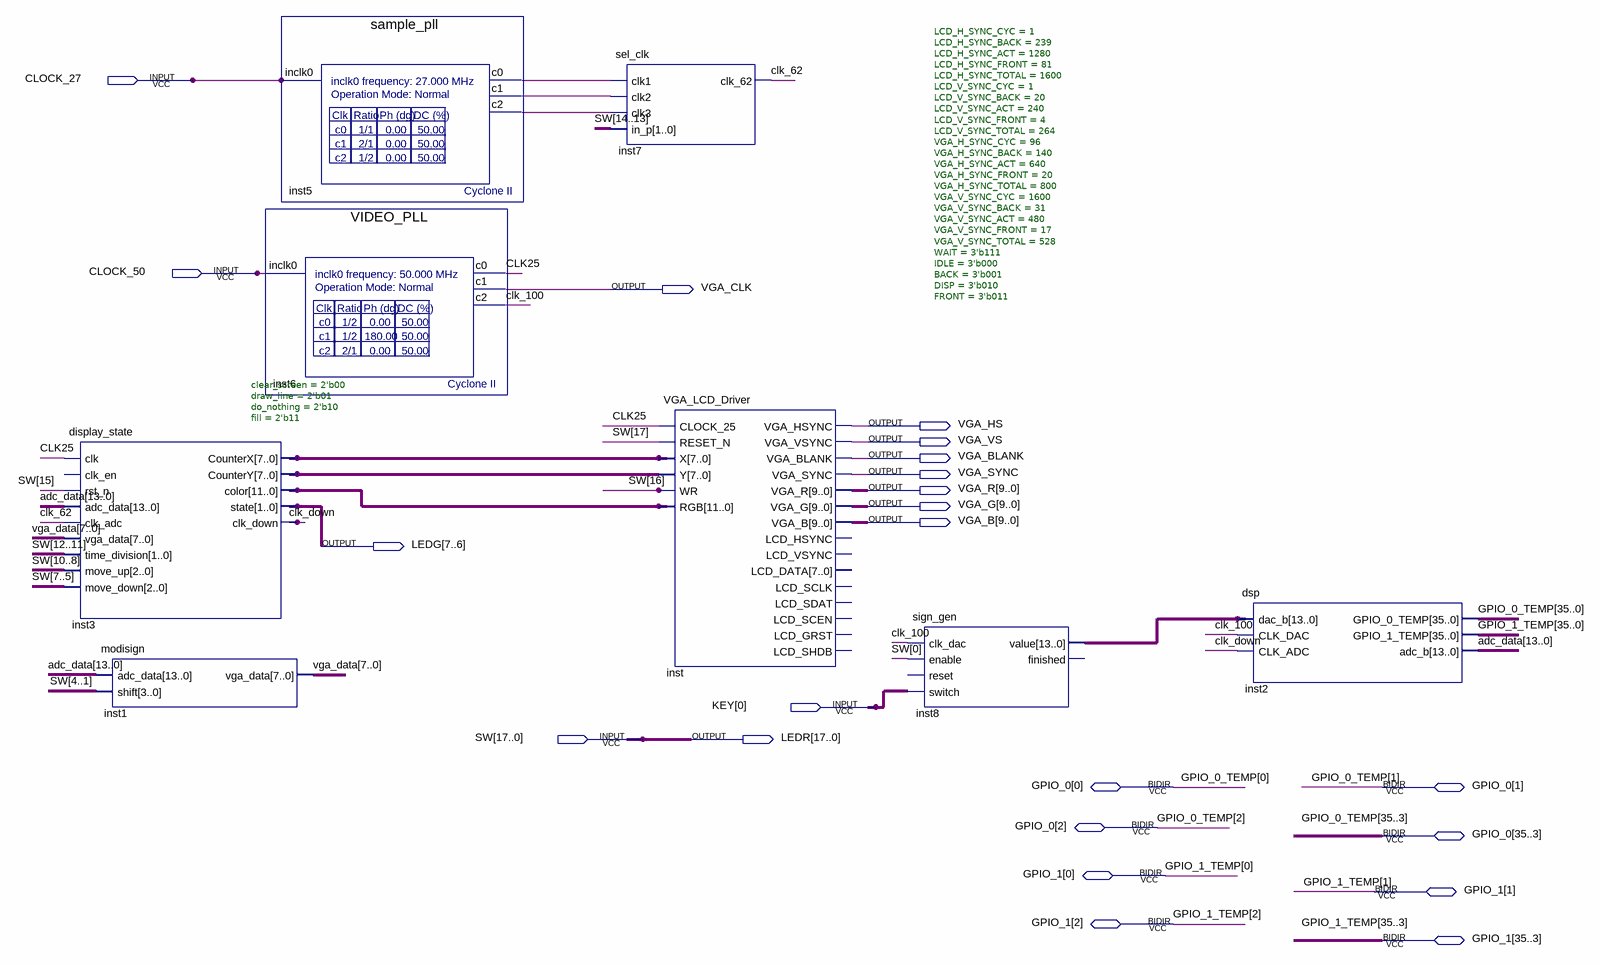
[diagram p0: schematic sheet]
// Quartus schematic LCM_VGA.bdf as structural Verilog: 8 symbols, 22 pins
module LCM_VGA (
  input  CLOCK_27,
  input  CLOCK_50,
  input  [0:0] KEY,
  input  [17:0] SW,
  inout  [35:0] GPIO_0,
  inout  [35:0] GPIO_1,
  output VGA_CLK,
  output VGA_HS,
  output VGA_VS,
  output VGA_BLANK,
  output VGA_SYNC,
  output [9:0] VGA_R,
  output [9:0] VGA_G,
  output [9:0] VGA_B,
  output [7:6] LEDG,
  output [17:0] LEDR
);

  wire CLK25, clk_62, clk_100, clk_down, inst5_c0, inst5_c1, inst5_c2;
  wire [7:0] inst3_counterx, inst3_countery, vga_data;
  wire [11:0] inst3_color;
  wire [13:0] adc_data, inst8_value;

  display_state #(.clear_screen(2'b00), .draw_line(2'b01), .do_nothing(2'b10), .fill(2'b11)) inst3 (
    .clk(CLK25), .rst_n(SW[15]), .adc_data(adc_data), .clk_adc(clk_62), .vga_data(vga_data),
    .time_division(SW[12:11]), .move_up(SW[10:8]), .move_down(SW[7:5]), .CounterX(inst3_counterx),
    .CounterY(inst3_countery), .color(inst3_color), .state(LEDG), .clk_down(clk_down));  // open: clk_en
  modisign inst1 (.adc_data(adc_data), .shift(SW[4:1]), .vga_data(vga_data));
  VIDEO_PLL inst6 (.inclk0(CLOCK_50), .c0(CLK25), .c1(VGA_CLK), .c2(clk_100));
  sample_pll inst5 (.inclk0(CLOCK_27), .c0(inst5_c0), .c1(inst5_c1), .c2(inst5_c2));
  sel_clk inst7 (.clk1(inst5_c0), .clk2(inst5_c1), .clk3(inst5_c2), .in_p(SW[14:13]), .clk_62(clk_62));
  VGA_LCD_Driver #(.LCD_H_SYNC_CYC(1), .LCD_H_SYNC_BACK(239), .LCD_H_SYNC_ACT(1280), .LCD_H_SYNC_FRONT(81), .LCD_H_SYNC_TOTAL(1600), .LCD_V_SYNC_CYC(1), .LCD_V_SYNC_BACK(20), .LCD_V_SYNC_ACT(240), .LCD_V_SYNC_FRONT(4), .LCD_V_SYNC_TOTAL(264), .VGA_H_SYNC_CYC(96), .VGA_H_SYNC_BACK(140), .VGA_H_SYNC_ACT(640), .VGA_H_SYNC_FRONT(20), .VGA_H_SYNC_TOTAL(800), .VGA_V_SYNC_CYC(1600), .VGA_V_SYNC_BACK(31), .VGA_V_SYNC_ACT(480), .VGA_V_SYNC_FRONT(17), .VGA_V_SYNC_TOTAL(528), .WAIT(3'b111), .IDLE(3'b000), .BACK(3'b001), .DISP(3'b010), .FRONT(3'b011)) inst (
    .CLOCK_25(CLK25), .RESET_N(SW[17]), .X(inst3_counterx), .Y(inst3_countery), .WR(SW[16]),
    .RGB(inst3_color), .VGA_HSYNC(VGA_HS), .VGA_VSYNC(VGA_VS), .VGA_BLANK(VGA_BLANK), .VGA_SYNC(VGA_SYNC),
    .VGA_R(VGA_R), .VGA_G(VGA_G), .VGA_B(VGA_B));  // open: LCD_HSYNC, LCD_VSYNC, LCD_DATA, LCD_SCLK, LCD_SDAT, LCD_SCEN, LCD_GRST, LCD_SHDB
  sign_gen inst8 (.clk_dac(clk_100), .enable(SW[0]), .switch(KEY[0]), .value(inst8_value));  // open: reset, finished
  dsp inst2 (
    .dac_b(inst8_value), .CLK_DAC(clk_100), .CLK_ADC(clk_down), .adc_b(adc_data), .GPIO_0_TEMP(GPIO_0),
    .GPIO_1_TEMP(GPIO_1));

  assign LEDR = SW;

  // Other names for the same wires on the sheet: GPIO_0_TEMP[35:0] = GPIO_0; GPIO_1_TEMP[35:0] = GPIO_1
endmodule
